# Altium schematic sheet Ethernet.SchDoc
size A3
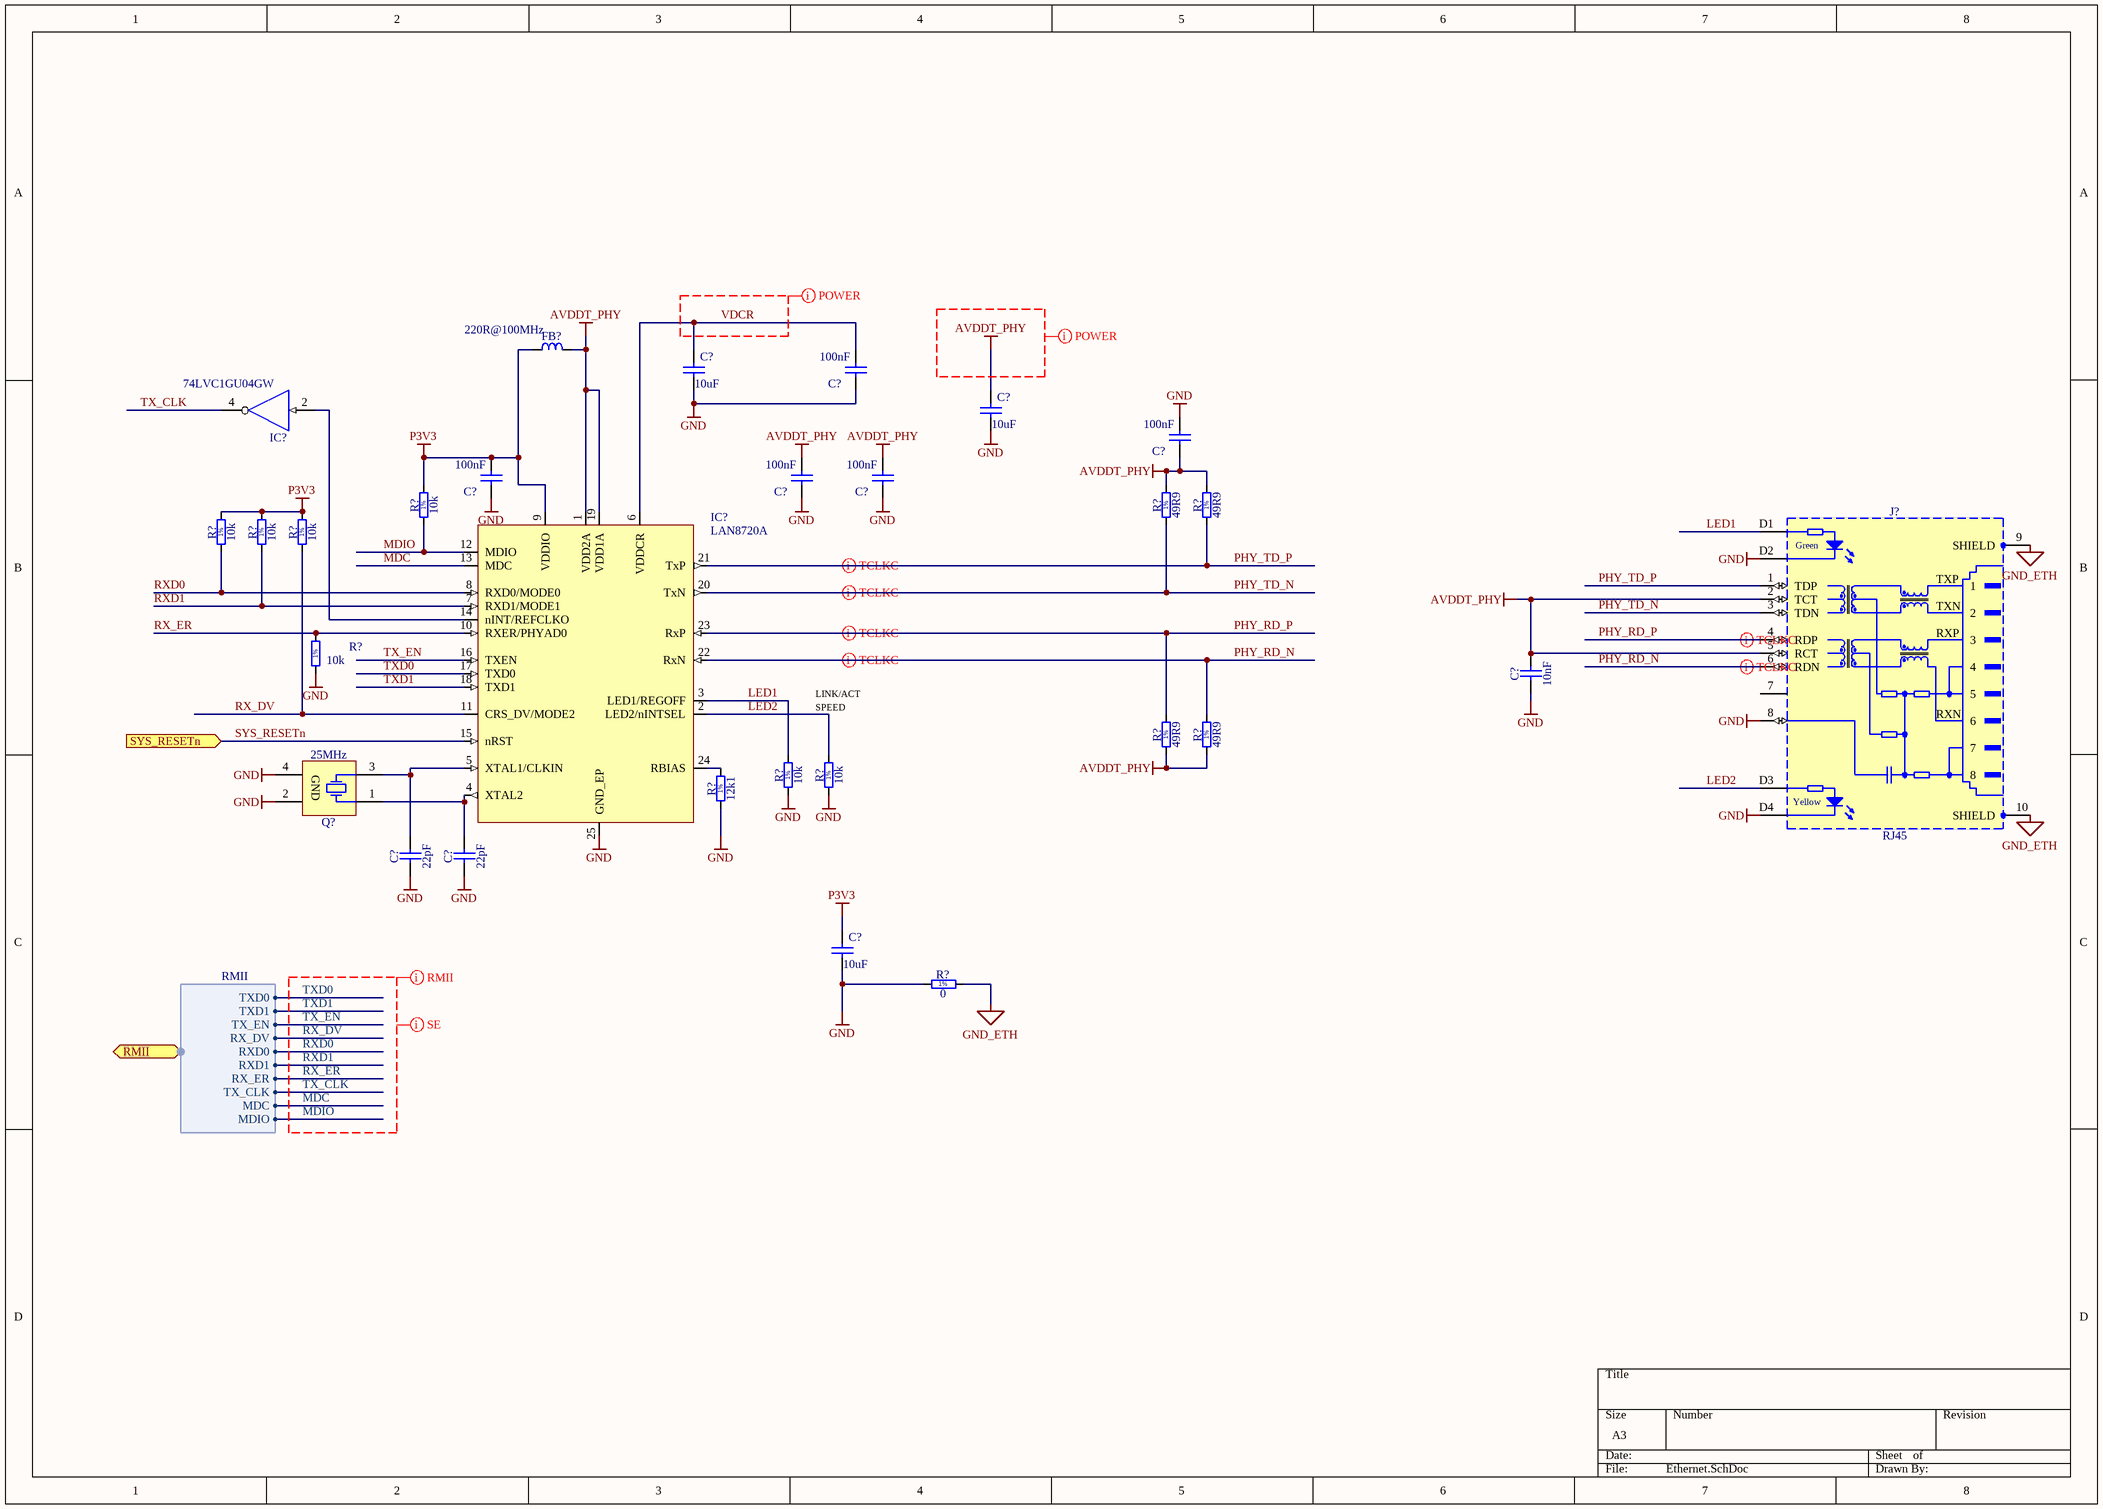
[diagram p0: Ethernet.SchDoc]

## Parts
(Parts that share a designator on the sheet are numbered #1, #2 ... from top to bottom, then left to right.)
C?#1  10uF  [CAPC2012X135N]
C?#2  100nF  [CAPC0603X33N]
C?#3  10uF  [CAPC2012X135N]
C?#4  100nF  [CAPC0603X33N]
C?#5  100nF  [CAPC0603X33N]
C?#6  100nF  [CAPC0603X33N]
C?#7  100nF  [CAPC0603X33N]
C?#8  10nF  [CAPC1608X87N]
C?#9  22pF  [CAPC1005X55N]
C?#10  22pF  [CAPC1005X55N]
C?#11  10uF  [CAPC2012X135N]
FB?  220R@100MHz  [INDC2012X105N]
IC?#1  74LVC1GU04GW  [SOT65P212X110-5N]
IC?#2  LAN8720A  [QFN24-TP]
J?  RJ45  [TYCO_5-6605308-1]
Q?  25MHz  [XTAL_TXC_8Y]
R?#1  10k  [RESC1005X40N]
R?#2  49R9  [RESC1005X40N]
R?#3  49R9  [RESC1005X40N]
R?#4  10k  [RESC1005X40N]
R?#5  10k  [RESC1005X40N]
R?#6  10k  [RESC1005X40N]
R?#7  10k  [RESC1005X40N]
R?#8  49R9  [RESC1005X40N]
R?#9  49R9  [RESC1005X40N]
R?#10  10k  [RESC1005X40N]
R?#11  10k  [RESC1005X40N]
R?#12  12k1  [RESC1005X40N]
R?#13  0  [RESC1608X55N]

## Ports
RMII (harness RMII), SYS_RESETn (in)

## Harnesses
RMII: TXD0, TXD1, TX_EN, RX_DV, RXD0, RXD1, RX_ER, TX_CLK, MDC, MDIO

## Nets
AVDDT_PHY: C?#3.1 C?#4.1 C?#6.2 C?#7.2 C?#8.2 FB?.2 IC?#2.1(VDD2A) IC?#2.19(VDD1A) J?.2(TCT) J?.5(RCT) R?#2.2 R?#3.2 R?#8.1 R?#9.1
GND: C?#1.2 C?#2.1 C?#3.2 C?#4.2 C?#5.1 C?#6.1 C?#7.1 C?#8.1 C?#9.1 C?#10.1 C?#11.2 IC?#1.3(GND) IC?#2.25(GND_EP) J?.8 J?.D2 J?.D4 Q?.2(GND) Q?.4(GND) R?#7.1 R?#10.1 R?#11.1 R?#12.1 R?#13.1
GND_ETH: J?.9(SHIELD) J?.10(SHIELD) R?#13.2
P3V3: C?#5.2 C?#11.1 FB?.1 IC?#1.5(VCC) IC?#2.9(VDDIO) R?#1.2 R?#4.2 R?#5.2 R?#6.2
LED1: IC?#2.3(LED1/REGOFF) J?.D1 R?#10.2
LED2: IC?#2.2(LED2/nINTSEL) J?.D3 R?#11.2
MDC: IC?#2.13(MDC) ; port RMII.MDC
MDIO: IC?#2.12(MDIO) R?#1.1 ; port RMII.MDIO
PHY_RD_N: IC?#2.22(RxN) J?.6(RDN) R?#9.2
PHY_RD_P: IC?#2.23(RxP) J?.4(RDP) R?#8.2
PHY_TD_N: IC?#2.20(TxN) J?.3(TDN) R?#2.1
PHY_TD_P: IC?#2.21(TxP) J?.1(TDP) R?#3.1
RX_DV: IC?#2.11(CRS_DV/MODE2) R?#6.1 ; port RMII.RX_DV
RX_ER: IC?#2.10(RXER/PHYAD0) R?#7.2 ; port RMII.RX_ER
RXD0: IC?#2.8(RXD0/MODE0) R?#4.1 ; port RMII.RXD0
RXD1: IC?#2.7(RXD1/MODE1) R?#5.1 ; port RMII.RXD1
SYS_RESETn: IC?#2.15(nRST) ; port SYS_RESETn
TX_CLK: IC?#1.4(OUT) ; port RMII.TX_CLK
TX_EN: IC?#2.16(TXEN) ; port RMII.TX_EN
TXD0: IC?#2.17(TXD0) ; port RMII.TXD0
TXD1: IC?#2.18(TXD1) ; port RMII.TXD1
VDCR: C?#1.1 C?#2.2 IC?#2.6(VDDCR)
NetC?#9_2: C?#9.2 IC?#2.5(XTAL1/CLKIN) Q?.3(X)
NetC?#10_2: C?#10.2 IC?#2.4(XTAL2) Q?.1(X)
NetIC?#1_2: IC?#1.2(IN) IC?#2.14(nINT/REFCLKO)
NetIC?#2_24: IC?#2.24(RBIAS) R?#12.2

Not connected (* = marked no-connect by the designer): J? 7

## Layout directives
differential pair: PHY_RD_N, PHY_RD_P, PHY_TD_N, PHY_TD_P
net class RMII: MDC, MDIO, RX_DV, RX_ER, RXD0, RXD1, TX_CLK, TX_EN, TXD0, TXD1
net class SE: MDC, MDIO, RX_DV, RX_ER, RXD0, RXD1, TX_CLK, TX_EN, TXD0, TXD1
net class POWER: AVDDT_PHY, VDCR

## Notes on the sheet
- (near R?#11) SPEED
- LINK/ACT
- (in symbol R0402_10K_1%_0.0625W_100PPM) 1%
- (in symbol R0402_12K1_1%_0.0625W_100PPM) 1%
- (in symbol R0402_49R9_1%_0.0625W_100PPM) 1%
- (in symbol R0603_0R_JUMPER) 1%
- (in symbol TYCO_5-6605308-1) Green; TXP; TXN; RXP; RXN; Yellow

## Library data of the parts
C?#1 C?#3 C?#11 = CC0805_10UF_10V_10%_X7R: Non-polarised capacitor; Part Description: SMD Multilayer Chip Ceramic Capacitor; Manufacturer: GENERIC; Manufacturer1 Part Number: GRM21BR71A106KE51L; Voltage: 10V; TC: X7R; Tolerance: ±10%; Table: Capacitors SMD; Part Number: CC0805_10UF_10V_10%_X7R; Component Kind: Standard; Component Type: Standard; Pin Count: 2; Value: 10uF; Status: Preferred; Manufacturer Part Number: CC0805_10UF_10V_10%_X7R; Case: 0805; Mounted: Yes; Socket: No; SMD: Yes; Manufacturer1 Example: MURATA; Manufacturer1 ComponentHeight: 1.35mm; HelpURL: \\cern.ch\dfs\Applications\Altium\Datasheets\CC0805_X7R_MURATA.pdf; Author: CERN DEM JLC; CreateDate: 2012-04-30; LatestRevisionDate: 2012-04-30
C?#2 C?#4-C?#7 = CC0201_100NF_6.3V_10%_X5R: Non-polarised capacitor; Part Description: SMD Multilayer Chip Ceramic Capacitor; Manufacturer: GENERIC; Manufacturer1 Part Number: 02016D104KAT2A; Voltage: 6.3V; TC: X5R; Tolerance: ±10%; Table: Capacitors SMD; Part Number: CC0201_100NF_6.3V_10%_X5R; Component Kind: Standard; Component Type: Standard; Pin Count: 2; Value: 100nF; Status: Not Recommended; Manufacturer Part Number: CC0201_100NF_6.3V_10%_X5R; Case: 0201; Mounted: Yes; Socket: No; SMD: Yes; Manufacturer1 Example: AVX; Manufacturer1 ComponentHeight: 0.33mm; HelpURL: \\cern.ch\dfs\Applications\Altium\Datasheets\CC0201_X5R_AVX.pdf; Author: CERN DEM JLC; CreateDate: 2007-12-03; LatestRevisionDate: 2007-12-03
C?#8 = CC0603_10NF_50V_5%_C0G: Non-polarised capacitor; Part Description: SMD Multilayer Chip Ceramic Capacitor; Manufacturer: GENERIC; Manufacturer1 Part Number: C1608C0G1H103J080AA; Voltage: 50V; TC: C0G/NP0; Tolerance: ±5%; Part Number: CC0603_10NF_50V_5%_C0G; Component Kind: Standard; Component Type: Standard; Pin Count: 2; Value: 10nF; Status: Preferred; Manufacturer Part Number: CC0603_10NF_50V_5%_C0G; Case: 0603; Mounted: Yes; Socket: No; SMD: Yes; Sense: No; Manufacturer1 Example: TDK; Manufacturer1 ComponentHeight: 0.9mm; HelpURL: \\cern.ch\dfs\Applications\Altium\Datasheets\CC0603_C0G_TDK_C.pdf; Author: CERN DEM JLC; CreateDate: 10.12.2014; LatestRevisionDate: 10.12.2014
C?#9 C?#10 = CC0402_22PF_50V_5%_NP0: Non-polarised capacitor; Part Description: SMD Multilayer Chip Ceramic Capacitor; Manufacturer: GENERIC; Manufacturer1 Part Number: 223886915229; Voltage: 50V; TC: NP0; Tolerance: ±5%; Table: Capacitors SMD; Part Number: CC0402_22PF_50V_5%_NP0; Component Kind: Standard; Component Type: Standard; Pin Count: 2; Value: 22pF; Status: Not Recommended; Manufacturer Part Number: CC0402_22PF_50V_5%_NP0; Case: 0402; Mounted: Yes; Socket: No; SMD: Yes; Manufacturer1 Example: PHYCOMP; Manufacturer1 ComponentHeight: 0.55mm; HelpURL: \\cern.ch\dfs\Applications\Altium\Datasheets\CC0402_NP0_PHYCOMP.pdf; Author: CERN DEM JLC; CreateDate: 2007-12-03; LatestRevisionDate: 2007-12-03
FB? = IND0805_MURATA_BLM21PG221SN1D: Inductor; Part Description: SMD EMIFIL Suppression Chip Ferrite Bead; Manufacturer: MURATA; Power: 2A; Resistance: 0.05R; Tolerance: ±25%; Table: Inductors SMD; Part Number: IND0805_MURATA_BLM21PG221SN1D; Component Kind: Standard; Component Type: Standard; Pin Count: 2; Value: 220R@100MHz; Status: None; Manufacturer Part Number: BLM21PG221SN1D; Case: 0805; Mounted: Yes; Socket: No; SMD: Yes; ComponentHeight: 1.05mm; HelpURL: \\cern.ch\dfs\Applications\Altium\Datasheets\IND0402_MURATA_BLM21P.pdf; Author: CERN DEM JLC; CreateDate: 2010-01-25; LatestRevisionDate: 2010-01-25
IC?#1 = 74LVC1GU04GW: Single Inverter Buffer; Manufacturer: NXP SEMICONDUCTORS; Table: Standard Logic; Part Number: 74LVC1GU04GW; Component Kind: Standard; Component Type: Standard; Device: 74LVC1GU04GW; PackageDescription: SOT353, SOT, 0.65mm Pitch, 5 pin, 1.25mm W X 2.05mm L X 1.10mm H, IPC Medium Density; Part Description: Inverter; Manufacturer Part Number: 74LVC1GU04GW; Pin Count: 3; Case: SOT353; Mounted: Yes; Socket: No; SMD: Yes; ComponentHeight: 1.1mm; Author: CERN DEM JLC; HelpURL: \\cern.ch\dfs\Applications\Altium\Datasheets\74LVC1GU04GW.pdf; CreateDate: 2011-01-11; LatestRevisionDate: 2011-01-11
IC?#2 = IFC_LAN8710A: RMII ethernet transceiver with auto MIDIX
J? = TYCO_5-6605308-1: 1 Port, Yellow/Green LEDs, RJ45 10/100Base-T Ethernet, Mag45 Connector Module With Integrated Magnetics; Manufacturer: TYCO ELECTRONICS; PressFit: No; Part Number: TYCO_5-6605308-1; Component Kind: Standard; Component Type: Standard; Pin Count: 14; Family: RJ45; Mounted: Yes; Socket: No; SMD: No; Sense: No; Status: None; Part Description: 1 Port, Yellow/Green LEDs, RJ45 10/100Base-T Ethernet, Mag45 Connector Module With Integrated Magnetics; Manufacturer Part Number: 5-6605308-1; ComponentHeight: 15.24mm; HelpURL: \\cern.ch\dfs\Applications\Altium\Datasheets\TYCO_5-6605308-1.pdf; Author: CERN DEM JLC; CreateDate: 23.08.2012; LatestRevisionDate: 23.08.2012
Q? = XTAL_25MHZ_TXC_8Y-25.000MAAJ-T: Crystal 4 pins 1=XTAL Control 2=GND3=XTAL 4=GND; Part Description: ±30ppm 18pF -20°C to +70°C  4 Pins, 2x1.6X0.5mm, SMD Seam Sealing Crystal, 8Y Serie; Manufacturer: TXC CORPORATION; PressFit: No; Bonding: No; Part Number: XTAL_25MHZ_TXC_8Y-25.000MAAJ-T; Component Kind: Standard; Component Type: Standard; PackageDescription: 4 Pins, 2x1.6X0.5mm, SMD Seam Sealing Crystal, 8Y Serie; Value: 25MHz; Manufacturer Part Number: 8Y-25.000MAAJ-T; Pin Count: 4; Mounted: Yes; Socket: No; SMD: Yes; Sense: No; ComponentHeight: 13.6mm; HelpURL: \\cern.ch\dfs\Applications\Altium\Datasheets\XTAL_TXC_8Y.pdf; Author: CERN DEM JLC; CreateDate: 08.03.2012; LatestRevisionDate: 08.03.2012
R?#1 R?#4-R?#7 R?#10 R?#11 = R0402_10K_1%_0.0625W_100PPM: Resistor - 1%; Part Description: General Purpose Thick Film Chip Resistor; Manufacturer: GENERIC; Manufacturer1 Part Number: 232270671003L; TC: ±100ppm/°C; Table: Resistors SMD; Part Number: R0402_10K_1%_0.0625W_100PPM; Component Kind: Standard; Component Type: Standard; Pin Count: 2; Value: 10k; Status: Not recommended; Power: 0.0625W; Tolerance: ±1%; Manufacturer Part Number: R0402_10K_1%_0.0625W_100PPM; Case: 0402; Mounted: Yes; Socket: No; SMD: Yes; Manufacturer1 Example: YAGEO PHYCOMP; Manufacturer1 ComponentHeight: 0.4mm; HelpURL: \\cern.ch\dfs\Applications\Altium\Datasheets\R0402_Phycomp_RC0402.pdf; Author: CERN DEM JLC; CreateDate: 2007-12-03; LatestRevisionDate: 2012-10-17
R?#2 R?#3 R?#8 R?#9 = R0402_49R9_1%_0.0625W_100PPM: Resistor - 1%; Part Description: General Purpose Thick Film Chip Resistor; Manufacturer: GENERIC; Manufacturer1 Part Number: 232270674999L or RC0402FR-0749R9L; TC: ±100ppm/°C; Table: Resistors SMD; Part Number: R0402_49R9_1%_0.0625W_100PPM; Component Kind: Standard; Component Type: Standard; Pin Count: 2; Value: 49R9; Status: Not recommended; Power: 0.0625W; Tolerance: ±1%; Manufacturer Part Number: R0402_49R9_1%_0.0625W_100PPM; Case: 0402; Mounted: Yes; Socket: No; SMD: Yes; Manufacturer1 Example: YAGEO PHYCOMP; Manufacturer1 ComponentHeight: 0.4mm; HelpURL: \\cern.ch\dfs\Applications\Altium\Datasheets\R0402_Phycomp_RC0402.pdf; Author: CERN DEM JLC; CreateDate: 2012-10-24; LatestRevisionDate: 2012-10-24
R?#12 = R0402_12K1_1%_0.0625W_100PPM: Resistor - 1%; Part Description: General Purpose Thick Film Chip Resistor; Manufacturer: GENERIC; Manufacturer1 Part Number: 232270671213L or RC0402FR-0712K1L; TC: ±100ppm/°C; Table: Resistors SMD; Part Number: R0402_12K1_1%_0.0625W_100PPM; Component Kind: Standard; Component Type: Standard; Pin Count: 2; Value: 12k1; Status: Not recommended; Power: 0.0625W; Tolerance: ±1%; Manufacturer Part Number: R0402_12K1_1%_0.0625W_100PPM; Case: 0402; Mounted: Yes; Socket: No; SMD: Yes; Manufacturer1 Example: YAGEO PHYCOMP; Manufacturer1 ComponentHeight: 0.4mm; HelpURL: \\cern.ch\dfs\Applications\Altium\Datasheets\R0402_Phycomp_RC0402.pdf; Author: CERN DEM JLC; CreateDate: 2012-10-24; LatestRevisionDate: 2012-10-24
R?#13 = R0603_0R_JUMPER: Resistor - 1%; Part Description: 1A (0.05R Max DC Resistance) Zero Ohm Jumper; Manufacturer: GENERIC; Manufacturer1 Part Number: NRC06Z0; Table: Resistors SMD; Part Number: R0603_0R_JUMPER; Component Kind: Standard; Component Type: Standard; Pin Count: 2; Value: 0; Status: Preferred; Manufacturer Part Number: R0603_0R_JUMPER; Case: 0603; Mounted: Yes; Socket: No; SMD: Yes; Manufacturer1 Example: NIC COMPONENT; Manufacturer1 ComponentHeight: 0.55mm; HelpURL: \\cern.ch\dfs\Applications\Altium\Datasheets\R0603_NIC_NRC.pdf; Author: CERN DEM JLC; CreateDate: 2007-12-03; LatestRevisionDate: 2008-03-13